# Altium schematic sheet Wifi.SchDoc
size A3; CompanyName: Ok's Lab; Engineer: Oktay Topcu; SheetNumber: 6; SheetTotal: 7; UniqueID: 20200803; X2: A3; X3: 20200803; X4: r1.0; X6: 6; X7: 7; X8: Wifi.SchDoc
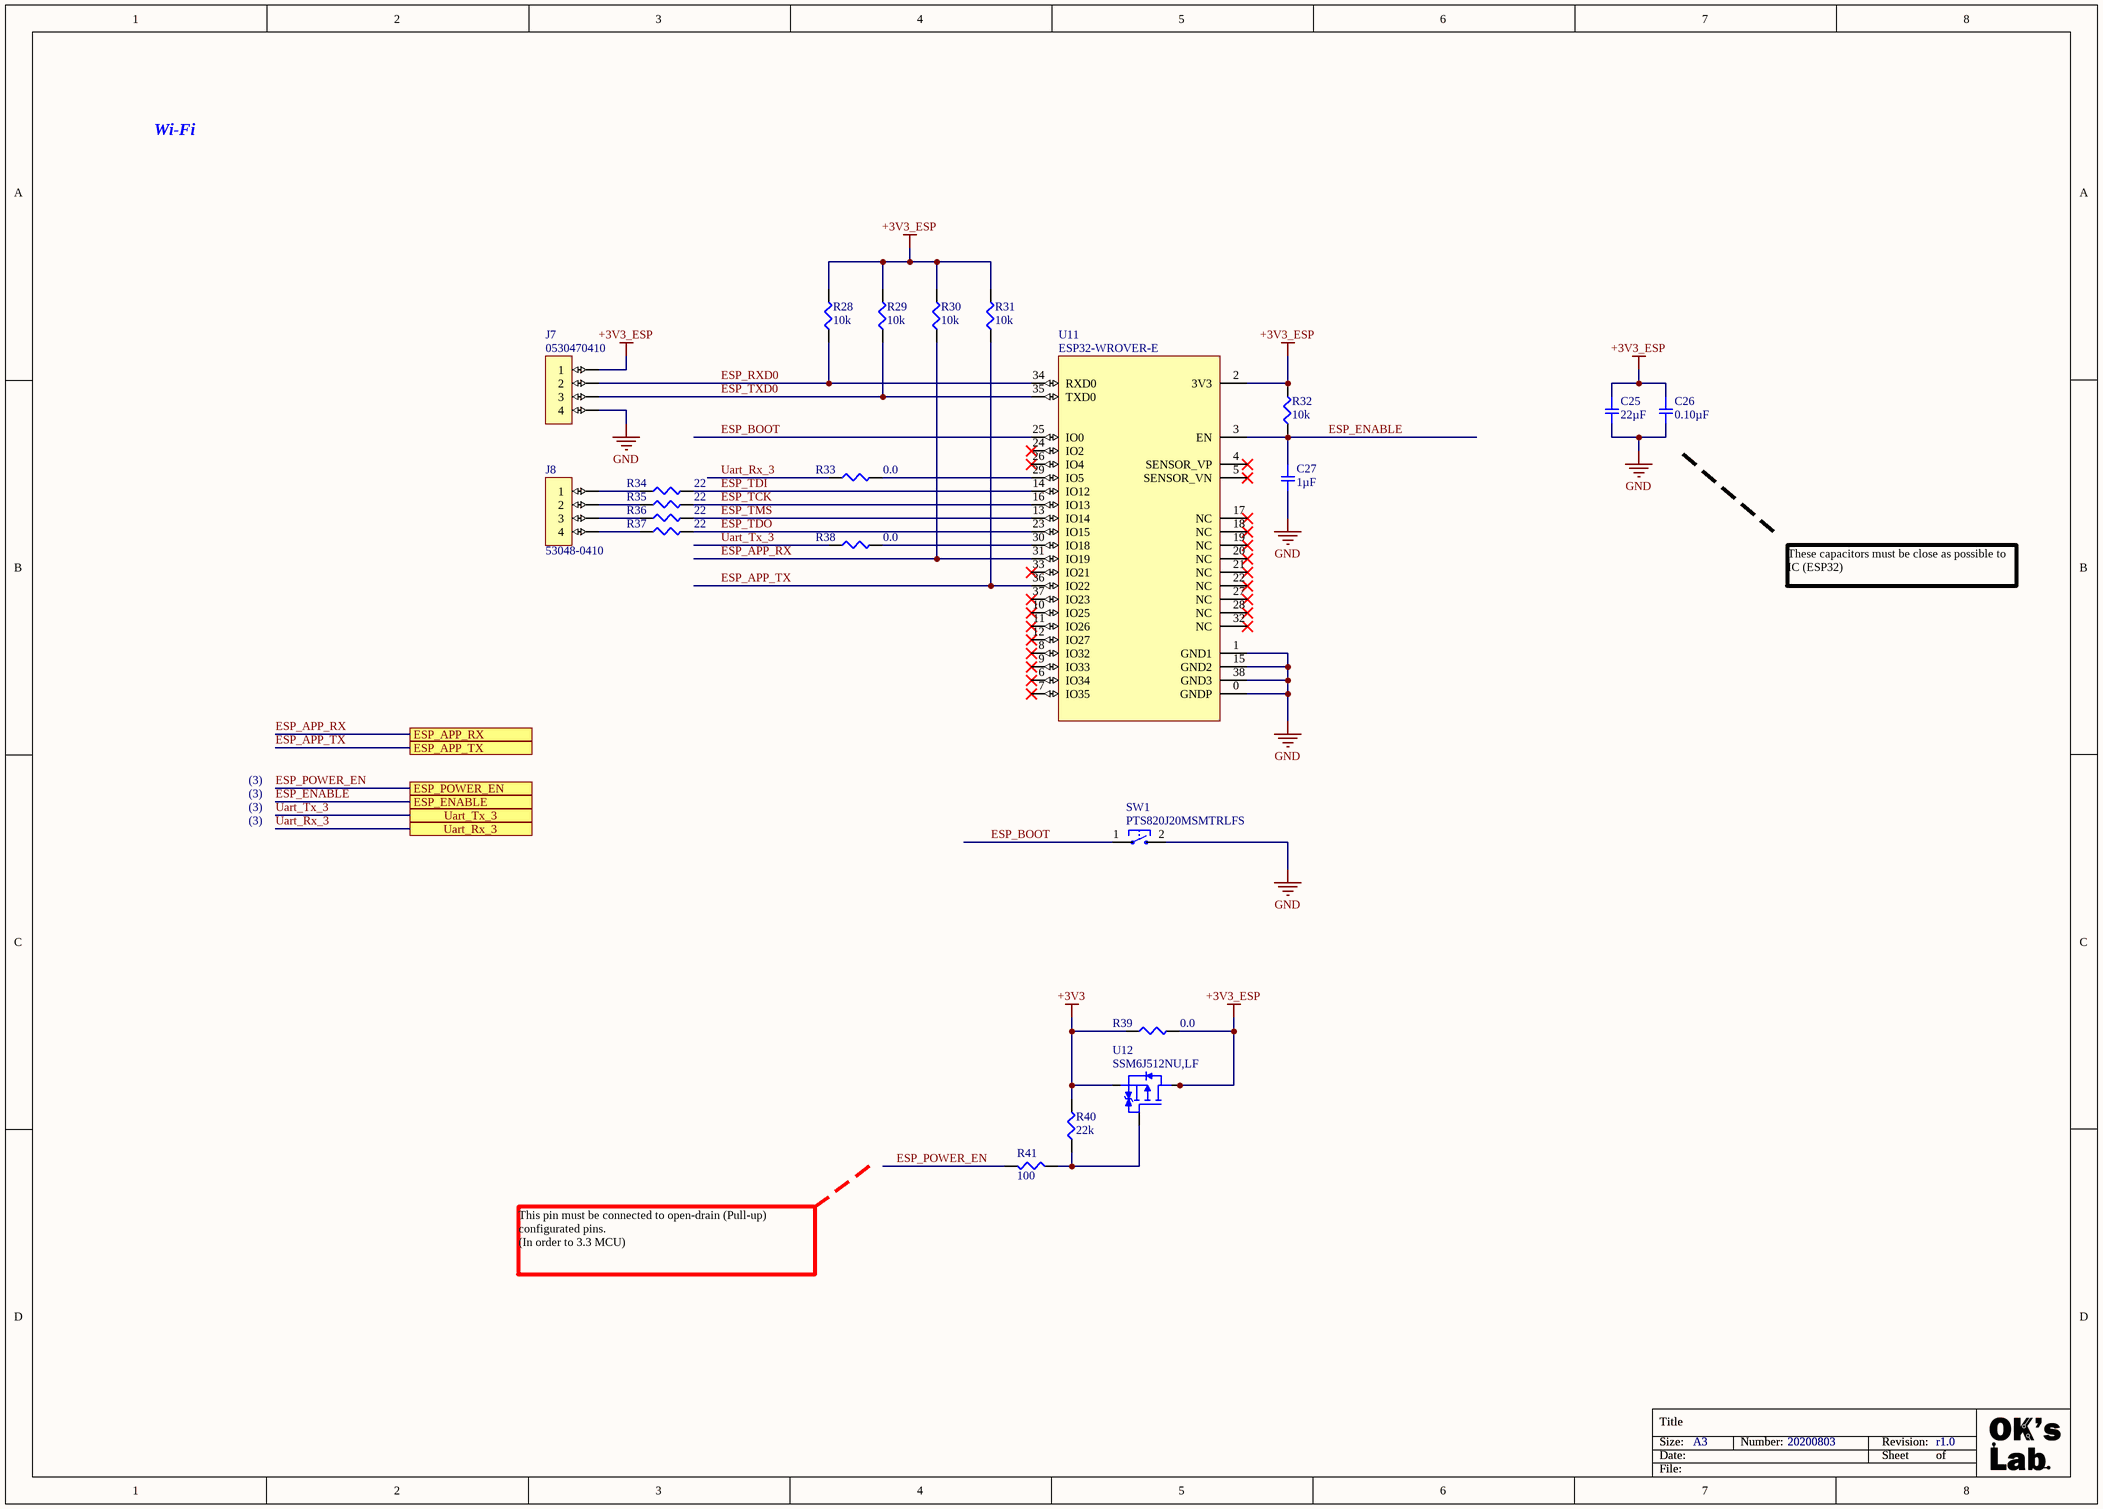
[diagram p0: Wifi.SchDoc]

## Parts
C25  22µF  [SMD-0805C]
C26  0.10µF  [SMD-0603C]
C27  1µF  [SMD-0603C]
J7  0530470410  [CONN_4_POS__053047-0410]
J8  53048-0410  [CONN_4_POS__0530480410]
R28  10k  [SMD-0603-RES]
R29  10k  [SMD-0603-RES]
R30  10k  [SMD-0603-RES]
R31  10k  [SMD-0603-RES]
R32  10k  [SMD-0603-RES]
R33  0.0  [SMD-0603-RES]
R34  22  [SMD-0603-RES]
R35  22  [SMD-0603-RES]
R36  22  [SMD-0603-RES]
R37  22  [SMD-0603-RES]
R38  0.0  [SMD-0603-RES]
R39  0.0  [SMD-0603-RES]
R40  22k  [SMD-0603-RES]
R41  100  [SMD-0603-RES]
SW1  PTS820J20MSMTRLFS  [TACTILE_SWITCH__PTS820J25MSMTRLFS]
U11  ESP32-WROVER-E  [ESP32-WROVER-E]
U12  SSM6J512NU,LF  [U-DFN2020-6]

## Ports
ESP_APP_RX, ESP_APP_TX, ESP_ENABLE, ESP_POWER_EN, Uart_Rx_3, Uart_Tx_3

## Nets
+3V3: R39.1 R40.2 U12.4(S)
+3V3_ESP: C25.1 C26.1 J7.1 R28.2 R29.2 R30.2 R31.2 R32.2 R39.2 U11.2(3V3) U12.1(D) U12.2(D) U12.5(D) U12.6(D)
GND: C25.2 C26.2 C27.2 J7.4 SW1.2 U11.0(GNDP) U11.1(GND1) U11.15(GND2) U11.38(GND3)
ESP_APP_RX: R30.1 U11.31(IO19) ; port ESP_APP_RX
ESP_APP_TX: R31.1 U11.36(IO22) ; port ESP_APP_TX
ESP_BOOT: SW1.1 U11.25(IO0)
ESP_ENABLE: C27.1 R32.1 U11.3(EN) ; port ESP_ENABLE
ESP_POWER_EN: R41.2 ; port ESP_POWER_EN
ESP_RXD0: J7.2 R28.1 U11.34(RXD0)
ESP_TCK: R35.2 U11.16(IO13)
ESP_TDI: R34.2 U11.14(IO12)
ESP_TDO: R37.2 U11.23(IO15)
ESP_TMS: R36.2 U11.13(IO14)
ESP_TXD0: J7.3 R29.1 U11.35(TXD0)
Uart_Rx_3: R33.1 ; port Uart_Rx_3
Uart_Tx_3: R38.1 ; port Uart_Tx_3
NetJ8_1: J8.1 R34.1
NetJ8_2: J8.2 R35.1
NetJ8_3: J8.3 R36.1
NetJ8_4: J8.4 R37.1
NetR33_2: R33.2 U11.29(IO5)
NetR38_2: R38.2 U11.30(IO18)
NetR40_1: R40.1 R41.1 U12.3(G)

Not connected (* = marked no-connect by the designer): U11 4(SENSOR_VP)* 5(SENSOR_VN)* 6(IO34)* 7(IO35)* 8(IO32)* 9(IO33)* 10(IO25)* 11(IO26)* 12(IO27)* 17(NC)* 18(NC)* 19(NC)* 20(NC)* 21(NC)* 22(NC)* 24(IO2)* 26(IO4)* 27(NC)* 28(NC)* 32(NC)* 33(IO21)* 37(IO23)*

## Notes on the sheet
- Wi-Fi
- These capacitors must be close as possible to IC (ESP32)
- (3)
- This pin must be connected to open-drain (Pull-up) configurated pins.
  (In order to 3.3 MCU)
- Title
- Size:
- Date:
- Number:
- Revision:
- Sheet
- of
- File:

## Library data of the parts
C25 = GRM21BC80J226ME51L: CAP CER 22UF 6.3V X6S 0805; Manufacturer: Murata Electronics North America; Factory Stock: 0; Unit Price (USD): 0.24; Minimum Quantity: 1; Tolerance: ±20%; Datasheets: http://www.murata.com/~/media/webrenewal/support/library/catalog/products/capacitor/mlcc/c02e.pdf; Image: //media.digikey.com/Renders/Murata%20Renders/0805%20(2012%20Metric)%20.85mm.jpg; Digi-Key Part Number: 490-9955-1-ND; Part Number: GRM21BC80J226ME51L; Quantity Available: 773; @ qty: 0; Packaging: Cut Tape (CT); Series: GRM; Part Status: Active; Value: 22µF; Voltage: 6.3V; Temperature Coefficient: X6S; Operating Temperature: -55°C ~ 105°C; Features: Derating Recommended; Ratings: -; Applications: General Purpose; Mounting Type: Surface Mount, MLCC; Package / Case: 0805 (2012 Metric); Size / Dimension: 0.079" L x 0.049" W (2.00mm x 1.25mm); Height - Seated (Max): -; Thickness (Max): 0.055" (1.40mm); Lead Spacing: -; Lead Style: -
C26 = GCJ188R71H104KA12D: CAP CER 0.1UF 50V X7R 0603; Manufacturer: Murata Electronics North America; Factory Stock: 0; Unit Price (USD): 0.12; Minimum Quantity: 1; Tolerance: ±10%; Datasheets: http://www.murata.com/~/media/webrenewal/support/library/catalog/products/capacitor/mlcc/c03e.ashx; Image: //media.digikey.com/Renders/Murata%20Renders/0603%28LQG18%29.jpg; Digi-Key Part Number: 490-5798-1-ND; Part Number: GCJ188R71H104KA12D; Quantity Available: 163695; @ qty: 0; Packaging: Cut Tape (CT); Series: GCJ; Part Status: Active; Value: 0.10µF; Voltage: 50V; Temperature Coefficient: X7R; Operating Temperature: -55°C ~ 125°C; Features: Soft Termination; Ratings: AEC-Q200; Applications: Automotive, Boardflex Sensitive; Mounting Type: Surface Mount, MLCC; Package / Case: 0603 (1608 Metric); Size / Dimension: 0.063" L x 0.031" W (1.60mm x 0.80mm); Height - Seated (Max): -; Thickness (Max): 0.035" (0.90mm); Lead Spacing: -; Lead Style: -
C27 = GCM188R71C105KA64D: CAP CER 1UF 16V X7R 0603; Manufacturer: Murata Electronics North America; Factory Stock: 0; Unit Price (USD): 0.24; Minimum Quantity: 1; Tolerance: ±10%; Datasheets: http://www.murata.com/~/media/webrenewal/support/library/catalog/products/capacitor/mlcc/c03e.ashx; Image: //media.digikey.com/Renders/Murata%20Renders/0603%28GCM188%29.jpg; Digi-Key Part Number: 490-5241-1-ND; Part Number: GCM188R71C105KA64D; Quantity Available: 9243; @ qty: 0; Packaging: Cut Tape (CT); Series: GCM; Part Status: Active; Value: 1µF; Voltage: 16V; Temperature Coefficient: X7R; Operating Temperature: -55°C ~ 125°C; Features: -; Ratings: AEC-Q200; Applications: Automotive; Mounting Type: Surface Mount, MLCC; Package / Case: 0603 (1608 Metric); Size / Dimension: 0.063" L x 0.031" W (1.60mm x 0.80mm); Height - Seated (Max): -; Thickness (Max): 0.035" (0.90mm); Lead Spacing: -; Lead Style: -
J7 = CONN_4_POS__53047-0410: 1.25mm (.049") Pitch PicoBlade Wire-to-Board Header, Vertical, with Friction Lock, 4 Circuits; Manufacturer: Molex; Number of Contacts: 4; Contact Resistance: 20mR; Max Voltage Rating (AC): 125V; Connector Type: Blade Pin; Pitch: 0.049inch; Supplier 1: Avnet; Manufacturer Part Number: 0530470410; Stock 1: 65946; Pricing 1: 1=0.1162, 10=0.1145, 30=0.1129, 50=0.1112, 100=0.1088, 250=0.1063, 500=0.1038 (USD); Mount: Through Hole; Contact Plating: Tin; Contact Material: Bronze; Color: Natural; Housing Color: White; Housing Material: Nylon; Min Operating Temperature: -40°C; Max Operating Temperature: 85°C; Termination: Solder; Number of Rows: 1; Packaging: Tray; Number of Positions: 4; Orientation: Straight; Series: PicoBlade™ 53047; Contact Type: Blade Pin; Length: 6.75mm; Depth: 3.2mm; Contact Mating Length: 0.089inch; RoHS Compliant: Yes; ComponentLink1URL: http://components.arrow.com/part/dataview/2938462S4237926N3303?src-supplier=Arrow+Electronics; ComponentLink1Description: http://components.arrow.com/part/dataview/2938462S4237926N3303?src-supplier=Arrow+Electronics; Supplier Part Number 1: 0530470410
J8 = CONN_4_POS__0530480410: CONN HEADER R/A 4POS 1.25MM; Manufacturer: Molex; Contact Resistance: 20mR; Current Rating: 1A; Voltage Rating: 125V; Number of Positions: 4; Insulation Resistance: 100MR; Gender: Male; Connector Type: Blade Pin; Glow Wire Compliant: Non-compliant; Supplier 1: Avnet; Manufacturer Part Number: 53048-0410; Stock 1: 44; Pricing 1: 1=0.1232 (USD); Mount: Through Hole; Case/Package: 0410; Contact Material: Bronze,Tin; Contact Plating: Tin; Color: Natural; Housing Color: Natural; Housing Material: Nylon; Min Operating Temperature: -40°C; Max Operating Temperature: 85°C; Package Quantity: 5000; Number of Rows: 1; Packaging: Tray; Contact Gender: Male; Termination: Solder; Number of Contacts: 4; Orientation: Right Angle; Number of Circuits: 4; Voltage Rating (DC): 125V; Series: PicoBlade; Contact Type: Blade Pin; Pitch: 1.25mm; Depth: 5.5mm; Radiation Hardening: No; REACH SVHC: Unknown; Lead Free: Lead Free; Flammability Rating: UL94 V-0; RoHS Compliant: Yes; ComponentLink1URL: https://www.distrelec.biz/Web/Downloads/60/_e/gg116847-116860_e.pdf?mime=application%2Fpdf&src-supplier=Distrelec; ComponentLink1Description: https://www.distrelec.biz/Web/Downloads/60/_e/gg116847-116860_e.pdf?mime=application%2Fpdf&src-supplier=Distrelec; ComponentLink2URL: http://uk.rs-online.com/webdocs/1362/0900766b81362ba7.pdf?src-supplier=RSComponents; ComponentLink2Description: http://uk.rs-online.com/webdocs/1362/0900766b81362ba7.pdf?src-supplier=RSComponents; ComponentLink3URL: http://www.molex.com/webdocs/datasheets/pdf/en-us/0530480410_PCB_HEADERS.pdf?src-supplier=Avnet; ComponentLink3Description: http://www.molex.com/webdocs/datasheets/pdf/en-us/0530480410_PCB_HEADERS.pdf?src-supplier=Avnet; ComponentLink4URL: http://www.mouser.com/ds/2/276/0530480410_PCB_HEADERS-170930.pdf?src-supplier=Mouser; ComponentLink4Description: http://www.mouser.com/ds/2/276/0530480410_PCB_HEADERS-170930.pdf?src-supplier=Mouser; Supplier Part Number 1: 53048-0410
R28-R32 = ERJ-3EKF1002V: RES SMD 10K OHM 1% 1/10W 0603; Manufacturer: Panasonic Electronic Components; Factory Stock: 0; Unit Price (USD): 0.00379; @ qty: 1500; Minimum Quantity: 1; Power (Watts): 0.1W, 1/10W; Temperature Coefficient: ±100ppm/°C; Part Number: ERJ-3EKF1002V; Datasheets: http://industrial.panasonic.com/www-cgi/jvcr13pz.cgi?E+PZ+3+AOA0002+ERJ3EKF1002V+7+WW; Image: //media.digikey.com/Photos/Panasonic%20Photos/MFG_ERJ-P6W%20Series.jpg; Digi-Key Part Number: P10.0KHCT-ND; Quantity Available: 6703141; Packaging: Cut Tape (CT); Series: ERJ; Part Status: Active; Value: 10k; Tolerance: ±1%; Composition: Thick Film; Features: Automotive AEC-Q200; Operating Temperature: -55°C ~ 155°C; Package / Case: 0603 (1608 Metric); Supplier Device Package: 0603; Size / Dimension: 0.063" L x 0.031" W (1.60mm x 0.80mm); Height - Seated (Max): 0.022" (0.55mm); Number of Terminations: 2; Failure Rate: -
R33 R38 R39 = ERJ-3GEY0R00V: RES SMD 0.0OHM JUMPER 1/10W 0603; Manufacturer: Panasonic Electronic Components; Factory Stock: 0; Unit Price (USD): 0.00352; @ qty: 1500; Minimum Quantity: 1; Power (Watts): 0.1W, 1/10W; Part Number: ERJ-3GEY0R00V; Datasheets: http://industrial.panasonic.com/www-cgi/jvcr13pz.cgi?E+PZ+3+AOA0001+ERJ3GEY0R00V+7+WW; Image: //media.digikey.com/Photos/Panasonic%20Photos/MFG_ERJ-P6W%20Series.jpg; Digi-Key Part Number: P0.0GCT-ND; Quantity Available: 4813372; Packaging: Cut Tape (CT); Series: ERJ; Part Status: Active; Value: 0.0; Tolerance: Jumper; Composition: Thick Film; Features: Automotive AEC-Q200; Temperature Coefficient: -; Operating Temperature: -55°C ~ 155°C; Package / Case: 0603 (1608 Metric); Supplier Device Package: 0603; Size / Dimension: 0.063" L x 0.031" W (1.60mm x 0.80mm); Height - Seated (Max): 0.022" (0.55mm); Number of Terminations: 2; Failure Rate: -
R34-R37 = ERJ-3EKF22R0V: RES SMD 22 OHM 1% 1/10W 0603; Manufacturer: Panasonic Electronic Components; Factory Stock: 0; Unit Price (USD): 0.00379; @ qty: 1500; Minimum Quantity: 1; Power (Watts): 0.1W, 1/10W; Temperature Coefficient: ±100ppm/°C; Part Number: ERJ-3EKF22R0V; Datasheets: http://industrial.panasonic.com/www-cgi/jvcr13pz.cgi?E+PZ+3+AOA0002+ERJ3EKF22R0V+7+WW; Image: //media.digikey.com/Photos/Panasonic%20Photos/MFG_ERJ-P6W%20Series.jpg; Digi-Key Part Number: P22.0HCT-ND; Quantity Available: 100321; Packaging: Cut Tape (CT); Series: ERJ; Part Status: Active; Value: 22; Tolerance: ±1%; Composition: Thick Film; Features: Automotive AEC-Q200; Operating Temperature: -55°C ~ 155°C; Package / Case: 0603 (1608 Metric); Supplier Device Package: 0603; Size / Dimension: 0.063" L x 0.031" W (1.60mm x 0.80mm); Height - Seated (Max): 0.022" (0.55mm); Number of Terminations: 2; Failure Rate: -
R40 = ERJ-3EKF2202V: RES SMD 22K OHM 1% 1/10W 0603; Manufacturer: Panasonic Electronic Components; Factory Stock: 0; Unit Price (USD): 0.00379; @ qty: 1500; Minimum Quantity: 1; Power (Watts): 0.1W, 1/10W; Temperature Coefficient: ±100ppm/°C; Datasheets: http://industrial.panasonic.com/www-cgi/jvcr13pz.cgi?E+PZ+3+AOA0002+ERJ3EKF2202V+7+WW; Image: //media.digikey.com/Photos/Panasonic%20Photos/MFG_ERJ-P6W%20Series.jpg; Digi-Key Part Number: P22.0KHCT-ND; Quantity Available: 328790; Packaging: Cut Tape (CT); Series: ERJ; Part Status: Active; Value: 22k; Tolerance: ±1%; Composition: Thick Film; Features: Automotive AEC-Q200; Operating Temperature: -55°C ~ 155°C; Package / Case: 0603 (1608 Metric); Supplier Device Package: 0603; Size / Dimension: 0.063" L x 0.031" W (1.60mm x 0.80mm); Height - Seated (Max): 0.022" (0.55mm); Number of Terminations: 2; Failure Rate: -; Manufacturer Part Number: ERJ-3EKF2202V
R41 = ERJ-3EKF1000V: RES SMD 100 OHM 1% 1/10W 0603; Manufacturer: Panasonic Electronic Components; Factory Stock: 0; Unit Price (USD): 0.00379; @ qty: 1500; Minimum Quantity: 1; Power (Watts): 0.1W, 1/10W; Temperature Coefficient: ±100ppm/°C; Datasheets: http://industrial.panasonic.com/www-cgi/jvcr13pz.cgi?E+PZ+3+AOA0002+ERJ3EKF1000V+7+WW; Image: //media.digikey.com/Photos/Panasonic%20Photos/MFG_ERJ-P6W%20Series.jpg; Digi-Key Part Number: P100HCT-ND; Quantity Available: 1544120; Packaging: Cut Tape (CT); Series: ERJ; Part Status: Active; Value: 100; Tolerance: ±1%; Composition: Thick Film; Features: Automotive AEC-Q200; Operating Temperature: -55°C ~ 155°C; Package / Case: 0603 (1608 Metric); Supplier Device Package: 0603; Size / Dimension: 0.063" L x 0.031" W (1.60mm x 0.80mm); Height - Seated (Max): 0.022" (0.55mm); Number of Terminations: 2; Failure Rate: -; Manufacturer Part Number: ERJ-3EKF1000V
SW1 = TACTILE_SWITCH__PTS820 J20M SMTR LFS: Switch Tactile N.O. SPST Round Button J-Bend 0.05A 12VDC 1.57N SMD T/R; Manufacturer: ITT C&K; Mechanical Life: 200000Cycles; Operating Force: 160gf; Current Rating: 50mA; Voltage Rating (DC): 12V; Illumination Type: Non-Illuminated; Switch Travel: 0.2mm; Switch Function: Off-Mom; Actuator Type: Standard; Supplier 1: Avnet; Manufacturer Part Number: PTS820J20MSMTRLFS; Stock 1: 0; Pricing 1: 2500=0.3899, 5000=0.3776, 10000=0.3585, 15000=0.3489, 20000=0.3322, 25000=0.3227, 250000=0.1769 (USD); Mount: Surface Mount; Case/Package: SMD/SMT; Color: Silver; Contact Plating: Silver; Min Operating Temperature: -40°C; Max Operating Temperature: 85°C; Packaging: Tape and Reel; Throw Configuration: SPST; Package Quantity: 2500; RoHS Compliant: Yes; Lead Free: Lead Free; ComponentLink1URL: https://www.ckswitches.com/media/1474/pts820.pdf?src-supplier=Digi-Key; ComponentLink1Description: https://www.ckswitches.com/media/1474/pts820.pdf?src-supplier=Digi-Key; Supplier Part Number 1: Y97MT26B2MBFP
U11 = ESP32-WROVER-E (4MB): RX TXRX MOD WIFI PCB TRACE SMD; Manufacturer: ESPRESSIF; Unit: pcs; SuppliedAmount: 0; MinAmount: 1; Type of communications module: IoT; Interface: GPIO; Receiver sensitivity: -98dBm; Transmitter output power: 19.5dBm; Supply voltage: 3...3.6V DC; Components: ESP32-D0WD-V3; Flash memory capacity: 4MB; SRAM memory capacity: 8MB; Number of cores: 2; Kind of network: Bluetooth Low Energy; Band: 2.412...2.484GHz; Supplier 1: TME; Manufacturer Part Number: ESP32-WROVER-E; Category: IoT (WiFi/Bluetooth) modules; Stock 1: 1; Pricing 1: 1=3,65, 5=3,5, 25=3,4, 100=3,15 (USD); Weight: 2,696; Multiples: 1; Price Type: NET; Dimensions: 18x31.4x3.3mm; Mounting: SMD; Kind of antenna: PCB; ComponentLink1URL: http://www.tme.eu/en/details/esp32-wrover-e/iot-wifi-bluetooth-modules/espressif/; ComponentLink1Description: http://www.tme.eu/en/details/esp32-wrover-e/iot-wifi-bluetooth-modules/espressif/; Supplier Part Number 1: ESP32-WROVER-E
U12 = MOSFET__SSM6J512NU,LF: MOSFET P-CH 12V 10A 6UDFNB; Manufacturer: Toshiba; Rds On Max: 16.2mR; Input Capacitance: 1.4nF; Max Power Dissipation: 1.25W; Supplier 1: Avnet; Manufacturer Part Number: SSM6J512NU,LF; Stock 1: 0; Pricing 1: 3000=0.1209, 6000=0.1177, 12000=0.1122, 18000=0.109, 24000=0.1067, 30000=0.1035, 300000=0.1011 (USD); Mount: Surface Mount; Packaging: Tape and Reel; Drain to Source Voltage (Vdss): 12V; Continuous Drain Current (ID): 10A; ComponentLink1URL: http://www.mouser.com/ds/2/408/SSM6J512NU_datasheet_en_20150903-805986.pdf?src-supplier=Mouser; ComponentLink1Description: http://www.mouser.com/ds/2/408/SSM6J512NU_datasheet_en_20150903-805986.pdf?src-supplier=Mouser; ComponentLink2URL: http://toshiba.semicon-storage.com/info/docget.jsp?did=30386&prodName=SSM6J512NU&src-supplier=Digi-Key; ComponentLink2Description: http://toshiba.semicon-storage.com/info/docget.jsp?did=30386&prodName=SSM6J512NU&src-supplier=Digi-Key; Supplier Part Number 1: SSM6J512NU,LF